# Altium schematic sheet Output Display.SchDoc
size A; SheetNumber: 9; SheetTotal: 9
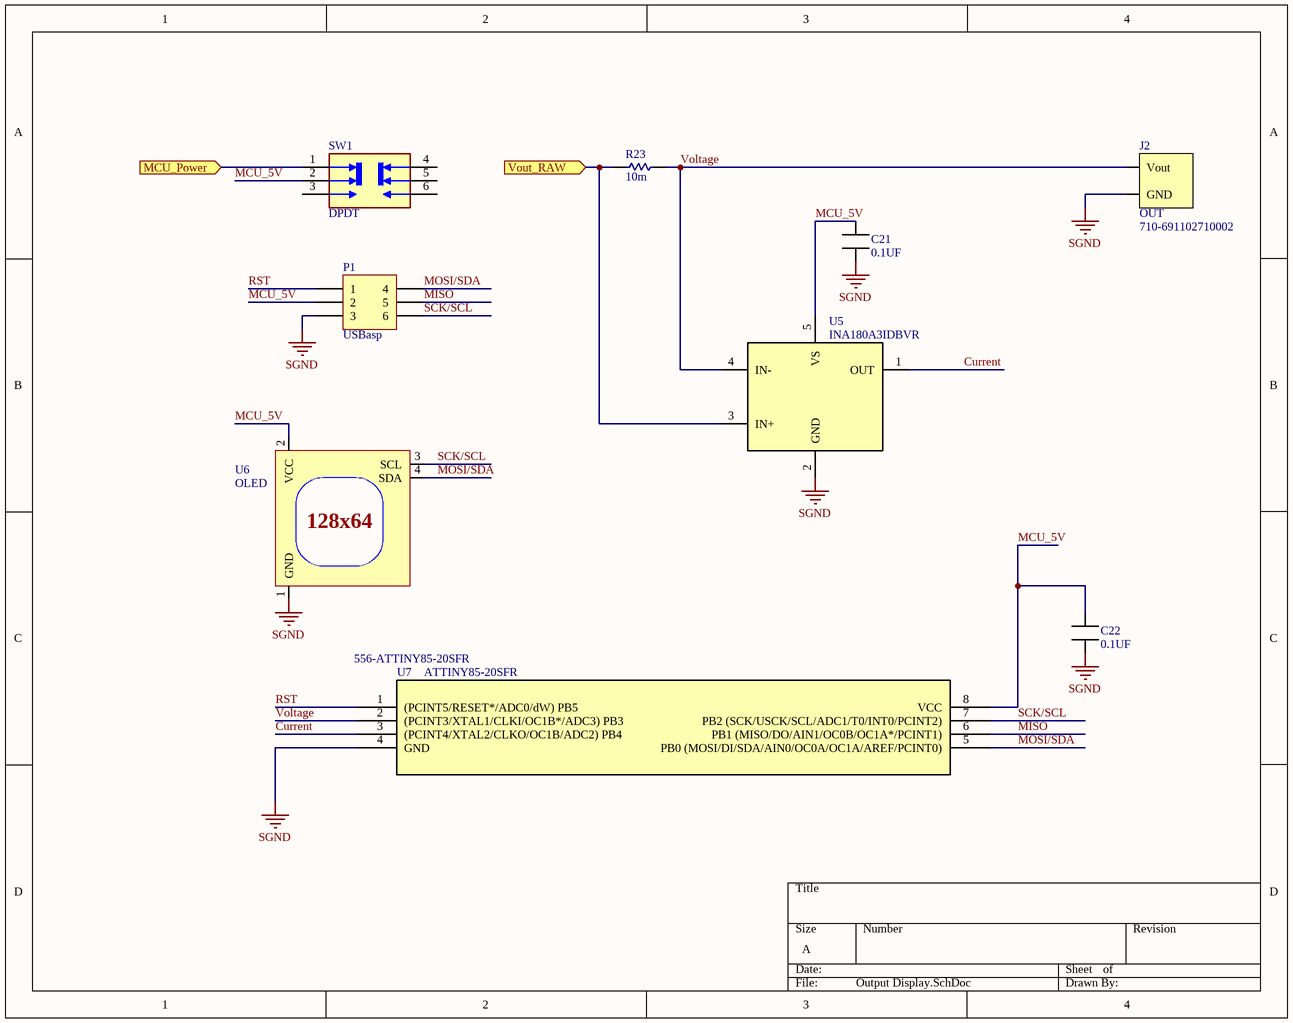
[diagram p0: Output Display.SchDoc]

## Parts
C21  0.1UF  [Cap 0603]
C22  0.1UF  [Cap 0603]
J2  OUT  Supplier Part Number 1: 710-691102710002  [691102710002]
P1  USBasp  [HDR2X3_CEN]  (no BOM)
R23  10m  [Cap 1206]
SW1  DPDT  [JS2020]
U5  INA180A3IDBVR  [SOT-23-5]
U6  OLED  [OLED]  (no BOM)
U7  ATTINY85-20SFR  Supplier Part Number 1: 556-ATTINY85-20SFR  [SOIC 8 ATTINY]

## Ports
MCU_Power (in), Vout_RAW (in)

## Nets
SGND: C21.1 C22.1 J2.2(GND) P1.3 U5.2(GND) U6.1(GND) U7.4(GND)
Current: U5.1(OUT) U7.3((PCINT4/XTAL2/CLKO/OC1B/ADC2)_PB4)
MCU_5V: C21.2 C22.2 P1.2 SW1.2 U5.5(VS) U6.2(VCC) U7.8(VCC)
MCU_Power: SW1.1 ; port MCU_Power
MISO: P1.5 U7.6(PB1_(MISO/DO/AIN1/OC0B/OC1A*/PCINT1))
MOSI/SDA: P1.4 U6.4(SDA) U7.5(PB0_(MOSI/DI/SDA/AIN0/OC0A/OC1A/AREF/PCINT0))
RST: P1.1 U7.1((PCINT5/RESET*/ADC0/dW)_PB5)
SCK/SCL: P1.6 U6.3(SCL) U7.7(PB2_(SCK/USCK/SCL/ADC1/T0/INT0/PCINT2))
Voltage: J2.1(Vout) R23.2(B) U5.4(IN-) U7.2((PCINT3/XTAL1/CLKI/OC1B*/ADC3)_PB3)
Vout_RAW: R23.1(A) U5.3(IN+) ; port Vout_RAW

Not connected (* = marked no-connect by the designer): SW1 3 4 5 6

## Notes on the sheet
- (in symbol 0.96 inch OLED) 128x64

## Library data of the parts
C21 C22 = C0603C104K3RAC: Multilayer Ceramic Capacitors MLCC - SMD/SMT 25V 0.1uF X7R 0603 10%; Supplier 1: Mouser; Supplier Part Number 1: 80-C0603C104K3RAC
J2 = 691102710002: Fixed Terminal Blocks WR-TBL 300VAC 15A 2P Straight; Supplier 1: Mouser
P1 = Header 3X2A: Header, 3-Pin, Dual row; LatestRevisionDate: 17-Jul-2002; LatestRevisionNote: Re-released for DXP Platform.; Publisher: Altium Limited
R23 = PA1206FRE070R01Z: Current Sense Resistors - SMD 10mOhms 1/4W 50PPM/C 1 % 1206 AEC-Q200; Supplier 1: Mouser; Supplier Part Number 1: 603-1206FRE070R01Z
SW1 = JS202011SCQN: SWITCH SLIDE DPDT 300MA 6V; Supplier 1: Mouser; Supplier Part Number 1: 611-JS202011SCQN
U5 = INA180A3IDBVR: Current Sense Amplifiers 26V, 350kHz current sense amplifier 5-SOT-23 -40 to 125; Supplier 1: Mouser; Supplier Part Number 1: 595-INA180A3IDBVR
U6 = 0.96 inch OLED: 0.96″ OLED 4pin LCD LED Display Module I2C IIC Communicate – White 128×64
U7 = ATTINY85-20SU: 8-bit Microcontrollers - MCU AVR 8K FLSH 512B EE 512B SRAM ADC 5V; Supplier 1: Mouser